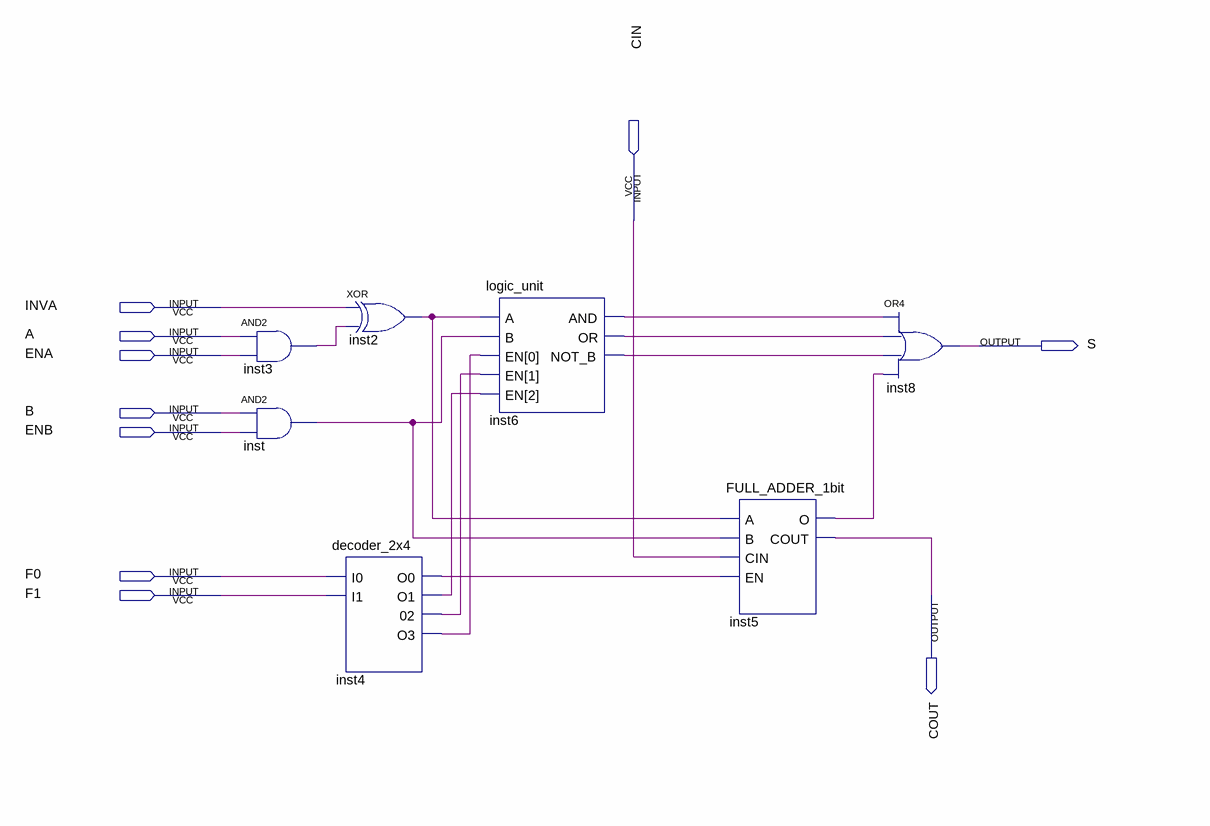
[diagram p0: schematic sheet]
// Quartus schematic ULA_1bit.bdf as structural Verilog: 7 symbols, 10 pins
module ULA_1bit (
  input  CIN,
  input  INVA,
  input  A,
  input  ENA,
  input  B,
  input  ENB,
  input  F0,
  input  F1,
  output S,
  output COUT
);

  wire inst2_out, inst3_out, inst4_02, inst4_o0, inst4_o1, inst4_o3, inst5_o, inst6_and, inst6_not_b,
       inst6_or, inst_out;

  and inst3 (inst3_out, A, ENA);
  and inst (inst_out, B, ENB);
  xor inst2 (inst2_out, INVA, inst3_out);
  decoder_2x4 inst4 (.I0(F0), .I1(F1), .O0(inst4_o0), .O1(inst4_o1), .\02 (inst4_02), .O3(inst4_o3));
  logic_unit inst6 (
    .A(inst2_out), .B(inst_out), .EN({inst4_o1, inst4_02, inst4_o3}), .AND(inst6_and), .OR(inst6_or),
    .NOT_B(inst6_not_b));
  FULL_ADDER_1bit inst5 (.A(inst2_out), .B(inst_out), .CIN(CIN), .EN(inst4_o0), .O(inst5_o), .COUT(COUT));
  or inst8 (S, inst6_and, inst6_or, inst6_not_b, inst5_o);
endmodule
